# Altium project EduSAT EPSv2.PrjPcb (part 1 of 2)
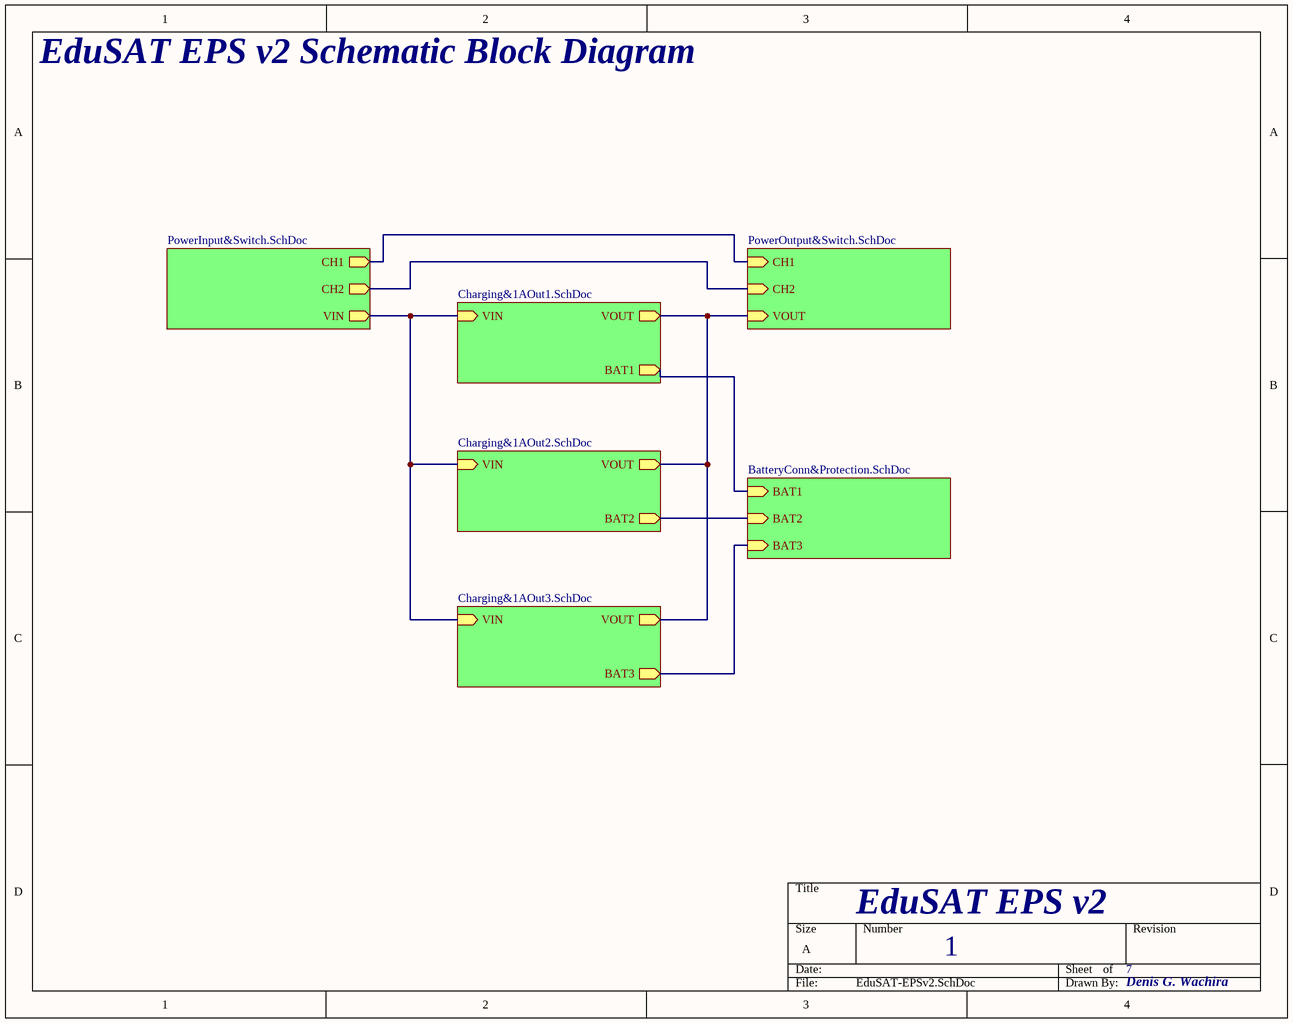
[diagram p0: EduSAT-EPSv2.SchDoc]
7 sheets, 128 parts. Net scope: hierarchical (ports join the sheet entries above them; power ports are global).
Board file: EduSAT-EPSv2.PcbDoc
Sheets:
  EduSAT-EPSv2.SchDoc
    U_BatteryConn&Protection = BatteryConn&Protection.SchDoc
    U_Charging&1AOut1 = Charging&1AOut1.SchDoc
    U_PowerInput&Switch = PowerInput&Switch.SchDoc
    U_Charging&1AOut2 = Charging&1AOut2.SchDoc
    U_Charging&1AOut3 = Charging&1AOut3.SchDoc
    U_PowerOutput&Switch = PowerOutput&Switch.SchDoc

## Sheet EduSAT-EPSv2.SchDoc
size A; DocumentNumber: 1; SheetNumber: 1; SheetTotal: 7

### Sub-sheets
U_BatteryConn&Protection = BatteryConn&Protection.SchDoc: BAT1 (in), BAT2 (in), BAT3 (in)
U_Charging&1AOut1 = Charging&1AOut1.SchDoc: VOUT (out), VIN (in), BAT1 (out)
U_Charging&1AOut2 = Charging&1AOut2.SchDoc: VOUT (out), VIN (in), BAT2 (out)
U_Charging&1AOut3 = Charging&1AOut3.SchDoc: VOUT (out), VIN (in), BAT3 (out)
U_PowerInput&Switch = PowerInput&Switch.SchDoc: CH1 (out), VIN (out), CH2 (out)
U_PowerOutput&Switch = PowerOutput&Switch.SchDoc: VOUT (in), CH1 (in), CH2 (in)

### Nets
BAT1: sheet U_BatteryConn&Protection/BAT1, sheet U_Charging&1AOut1/BAT1
BAT2: sheet U_BatteryConn&Protection/BAT2, sheet U_Charging&1AOut2/BAT2
BAT3: sheet U_BatteryConn&Protection/BAT3, sheet U_Charging&1AOut3/BAT3
SolVOUT: sheet U_PowerInput&Switch/CH2, sheet U_PowerOutput&Switch/CH2
U1VIOUT: sheet U_PowerInput&Switch/CH1, sheet U_PowerOutput&Switch/CH1
VIN: sheet U_Charging&1AOut1/VIN, sheet U_PowerInput&Switch/VIN, sheet U_Charging&1AOut2/VIN, sheet U_Charging&1AOut3/VIN
VOUT: sheet U_Charging&1AOut1/VOUT, sheet U_Charging&1AOut2/VOUT, sheet U_Charging&1AOut3/VOUT, sheet U_PowerOutput&Switch/VOUT

### Notes on the sheet
- EduSAT EPS v2 Schematic Block Diagram
- EduSAT EPS v2
- Denis G. Wachira

## Sheet BatteryConn&Protection.SchDoc
size A; DocumentNumber: 3; SheetNumber: 3; SheetTotal: 7
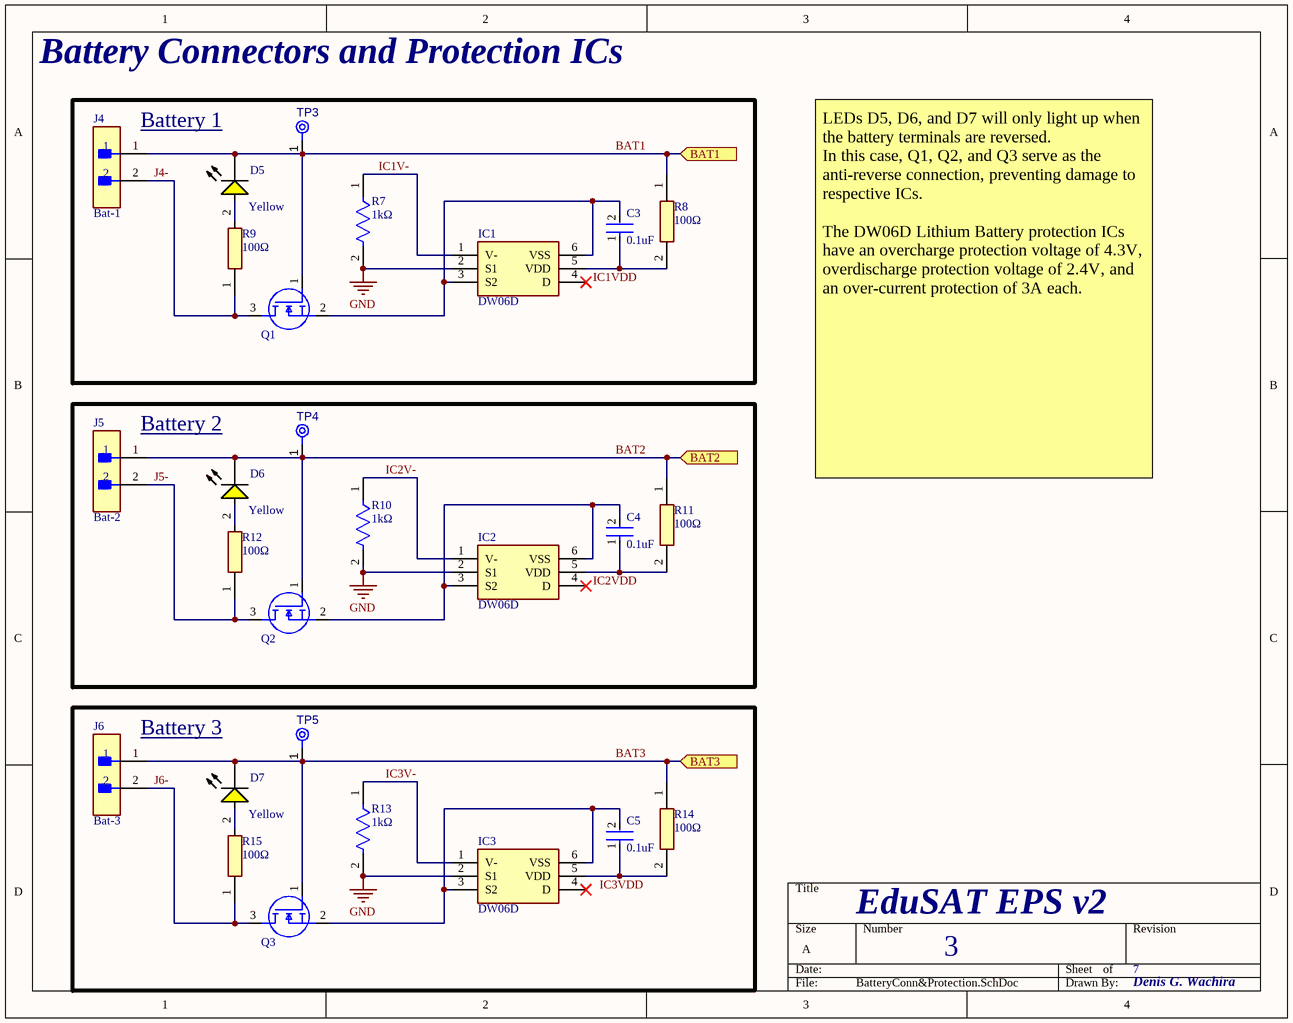
[diagram p1: BatteryConn&Protection.SchDoc]

### Parts
C3  0.1uF  [FP-CL21-IPC_A]
C4  0.1uF  [FP-CL21-IPC_A]
C5  0.1uF  [FP-CL21-IPC_A]
D5  Yellow  [LTST-C170KSKT_V]
D6  Yellow  [LTST-C170KSKT_V]
D7  Yellow  [LTST-C170KSKT_V]
IC1  DW06D  [SOT95P280X135-6N]
IC2  DW06D  [SOT95P280X135-6N]
IC3  DW06D  [SOT95P280X135-6N]
J4  Bat-1  [FP-S2B-XH-A-1_LF_SN-MFG]
J5  Bat-2  [FP-S2B-XH-A-1_LF_SN-MFG]
J6  Bat-3  [FP-S2B-XH-A-1_LF_SN-MFG]
Q1  (no value)  [SOT95P237X112-3N]
Q2  (no value)  [SOT95P237X112-3N]
Q3  (no value)  [SOT95P237X112-3N]
R7  1kΩ  [FP-MCR10-IPC_A]
R8  100Ω  [RESC2012X65N]
R9  100Ω  [RESC2012X65N]
R10  1kΩ  [FP-MCR10-IPC_A]
R11  100Ω  [RESC2012X65N]
R12  100Ω  [RESC2012X65N]
R13  1kΩ  [FP-MCR10-IPC_A]
R14  100Ω  [RESC2012X65N]
R15  100Ω  [RESC2012X65N]
TP3  TPAD6R  [TP06R]  (value not drawn)  (no BOM)
TP4  TPAD6R  [TP06R]  (value not drawn)  (no BOM)
TP5  TPAD6R  [TP06R]  (value not drawn)  (no BOM)

### Blocks framed on the sheet
Battery 1: C3 D5 IC1 J4 Q1 R7-R9 TP3
Battery 2: C4 D6 IC2 J5 Q2 R10-R12 TP4
Battery 3: C5 D7 IC3 J6 Q3 R13-R15 TP5

### Ports
BAT1 (in, see EduSAT-EPSv2[3B], Charging&1AOut1[4B]), BAT2 (in, see EduSAT-EPSv2[3C], Charging&1AOut2[4B]), BAT3 (in, see EduSAT-EPSv2[3C], Charging&1AOut3[4B])

### Nets
GND: IC1.2(S1) IC2.2(S1) IC3.2(S1) R7.2 R10.2 R13.2
BAT1: D5.2(K) J4.1 Q1.1(G) R8.1 TP3.1(TP) ; port BAT1
BAT2: D6.2(K) J5.1 Q2.1(G) R11.1 TP4.1(TP) ; port BAT2
BAT3: D7.2(K) J6.1 Q3.1(G) R14.1 TP5.1(TP) ; port BAT3
IC1V-: IC1.1(V-) R7.1
IC1VDD: C3.1 IC1.5(VDD) R8.2
IC2V-: IC2.1(V-) R10.1
IC2VDD: C4.1 IC2.5(VDD) R11.2
IC3V-: IC3.1(V-) R13.1
IC3VDD: C5.1 IC3.5(VDD) R14.2
J4-: J4.2 Q1.3(D) R9.1
J5-: J5.2 Q2.3(D) R12.1
J6-: J6.2 Q3.3(D) R15.1
NetC3_2: C3.2 IC1.3(S2) IC1.6(VSS) Q1.2(S)
NetC4_2: C4.2 IC2.3(S2) IC2.6(VSS) Q2.2(S)
NetC5_2: C5.2 IC3.3(S2) IC3.6(VSS) Q3.2(S)
NetD5_1: D5.1(A) R9.2
NetD6_1: D6.1(A) R12.2
NetD7_1: D7.1(A) R15.2

Not connected (* = marked no-connect by the designer): IC1 4(D)*; IC2 4(D)*; IC3 4(D)*

### Notes on the sheet
- Battery Connectors and Protection ICs
- LEDs D5, D6, and D7 will only light up when the battery terminals are reversed.
  In this case, Q1, Q2, and Q3 serve as the anti-reverse connection, preventing damage to respective ICs.
  The DW06D Lithium Battery protection ICs have an overcharge protection voltage of 4.3V, overdischarge protection voltage of 2.4V, and an over-current protection of 3A each.
- EduSAT EPS v2
- Denis G. Wachira

### Library data of the parts
C3-C5 = CMP-13271-002975-1: 50V 0.1uF X7R ±10% 0805 Multilayer Ceramic Capacitors MLCC - SMD/SMT ROHS TCC0805X7R104K500DT; Case Code (Imperial): 0805; Length: 2mm; Case/Package: 0805; Packaging: Tape and Reel; Width: 0.049inch; Tolerance: 10%; Mount: Surface Mount; Min Operating Temperature: -55°C; Thickness: 0.057inch; Height: 1.25mm; Dielectric: X7R; Package Quantity: 1; Depth: 1.25mm; Capacitance: 0.1uF; Voltage Rating: 50V; Case Code (Metric): 2012; Max Operating Temperature: 85°C; Radiation Hardening: No
D5-D7 = CMP-2000-06621-1: LED Yellow, 75 mW, 80 mA, -55 to 85 degC, 2-Pin SMD, RoHS, Tape and Reel KT-0805Y; Manufacturer: Lite-On; Main Category: ChipLED; Product Depth (mm): 1.25mm; Dominant Wave Length: 587nm; Viewing Angle: 130deg; Luminous Intensity: 112mcd; Test Current (It): 20mA; Emitting Color: Amber; Chip Material: AlGaInP; Product Height (mm): 1.1mm; Forward Voltage: 2.4V; High Brightness: Yes; Forward Current: 30mA; Number of  Elements: 1; Power Dissipation: 75W; Type: Uni-Color; Shape Type: Rectangular; Peak Wavelength: 588nm; Reverse Voltage: 5V; Rad Hardened: No; Product Length (mm): 2mm; DELETED: Compliant; Package Description: 2-Pin Surface Mount Device, Body 2 x 1.25 mm; Mounting: SurfaceMount; Lum Intensity: 112mcd; Pin Count: 2; Mounting Technology: SurfaceMount; Package Reference: C170KSKT; Datasheet Version: Rev. H, 04/2014; Package Type: ChipLed; Packaging: TapeandReel; Manufacturer URL: http://www.us.liteon.com/; Datasheet URL: http://optoelectronics.liteon.com/upload/download/DS-22-99-0188/S_110_LTST-C170KSKT.pdf; Operating Temp Range: -55Cto85C; Lens Dimensions: 1.4x1.25x0.6mm; Operating Temperature Classification: Industrial
IC1-IC3 = DW06D: Integrated Circuit; Manufacturer_Name: SHEN ZHEN FINE MAD ELECTRONICS GROUP; Datasheet Link: https://datasheet.lcsc.com/szlcsc/Shenzhen-Fuman-Elec-DW06D_C82123.pdf; Height: 1.35mm; Manufacturer_Part_Number: DW06D
J4-J6 = CMP-17439-000260-1: CONN HEADER R/A 2POS 2.5MM HCZZ0139-2; Voltage Rating: 250V; Number of Positions: 2; Contact Material: Brass; Series: XH; Contact Finish - Mating: TIN; Max Operating Temperature: 85°C; Number of Rows: 1; Packaging: Bulk; Insulation Color: Natural; Lead Free: Lead Free; Fastening Type: Detent; Termination: Press-Fit; Connector Type: Header; Insulation Material: Nylon; Contact Shape: Square; Contact Type: Male Pin; Mount: Through Hole; Min Operating Temperature: -25°C; Flammability Rating: UL94 V-0
Q1-Q3 = IRLML6344TRPBF: MOSFET (N-Channel)IRLML6344TRPBF; Manufacturer_Name: Infineon; Datasheet Link: https://www.infineon.com/dgdl/irlml6344pbf.pdf?fileId=5546d462533600a4015356689c44262c; Height: 1.12mm; Manufacturer_Part_Number: IRLML6344TRPBF; Mouser Part Number: 942-IRLML6344TRPBF; Mouser Price/Stock: https://www.mouser.co.uk/ProductDetail/Infineon-Technologies/IRLML6344TRPBF?qs=9%252BKlkBgLFf2w4qS48UOXVw%3D%3D; Arrow Part Number: IRLML6344TRPBF; Arrow Price/Stock: https://www.arrow.com/en/products/irlml6344trpbf/infineon-technologies-ag?region=europe
R7 R10 R13 = CMP-08839-023103-1: Thick Film Chip Resistor, 0805, 1kΩ, 1%, 100ppm/°C, 0.125W, 150V 0805W8F1001T5E; Power Rating: 125mW; Resistance: 1kR; Max Operating Temperature: 155°C; Length: 0.079inch; Case/Package: 0805; Tolerance: 1%; Mount: Surface Mount; Packaging: Tape and Reel; Number of Terminations: 2; Voltage Rating (DC): 150V; RoHS Compliant: Yes; Case Code (Metric): 2012; Lead Free: Lead Free; Max Power Dissipation: 125mW; Height: 0.024inch; Temperature Coefficient: 100ppm/°C; Resistor Type: Thick Film; Case Code (Imperial): 0805; Package Quantity: 5000; Contact Plating: Tin; Width: 0.049inch; Min Operating Temperature: -55°C
R8 R9 = AECR0805F27R0K9: 125mW Thick Film Resistors 150V ±100ppm/℃ ±1% 100Ω 0805 Chip Resistor - Surface Mount ROHS AECR0805F100RK9; Manufacturer_Name: ResistorToday; Datasheet Link: https://datasheet.lcsc.com/lcsc/2304140030_RESI-AECR0805F27R0K9_C352233.pdf; Height: 0.65mm; Manufacturer_Part_Number: AECR0805F27R0K9
R11 R12 R14 R15 = AECR0805F27R0K9: 125mW Thick Film Resistors 150V ±100ppm/℃ ±1% 100Ω 0805 Chip Resistor - Surface Mount ROHSAECR0805F100RK9; Manufacturer_Name: ResistorToday; Datasheet Link: https://datasheet.lcsc.com/lcsc/2304140030_RESI-AECR0805F27R0K9_C352233.pdf; Height: 0.65mm; Manufacturer_Part_Number: AECR0805F27R0K9
TP3-TP5 = CMP-00028-00002-2: 0.6mm round; Pins: 1

## Sheet Charging&1AOut1.SchDoc
size A; DocumentNumber: 4; SheetNumber: 4; SheetTotal: 7
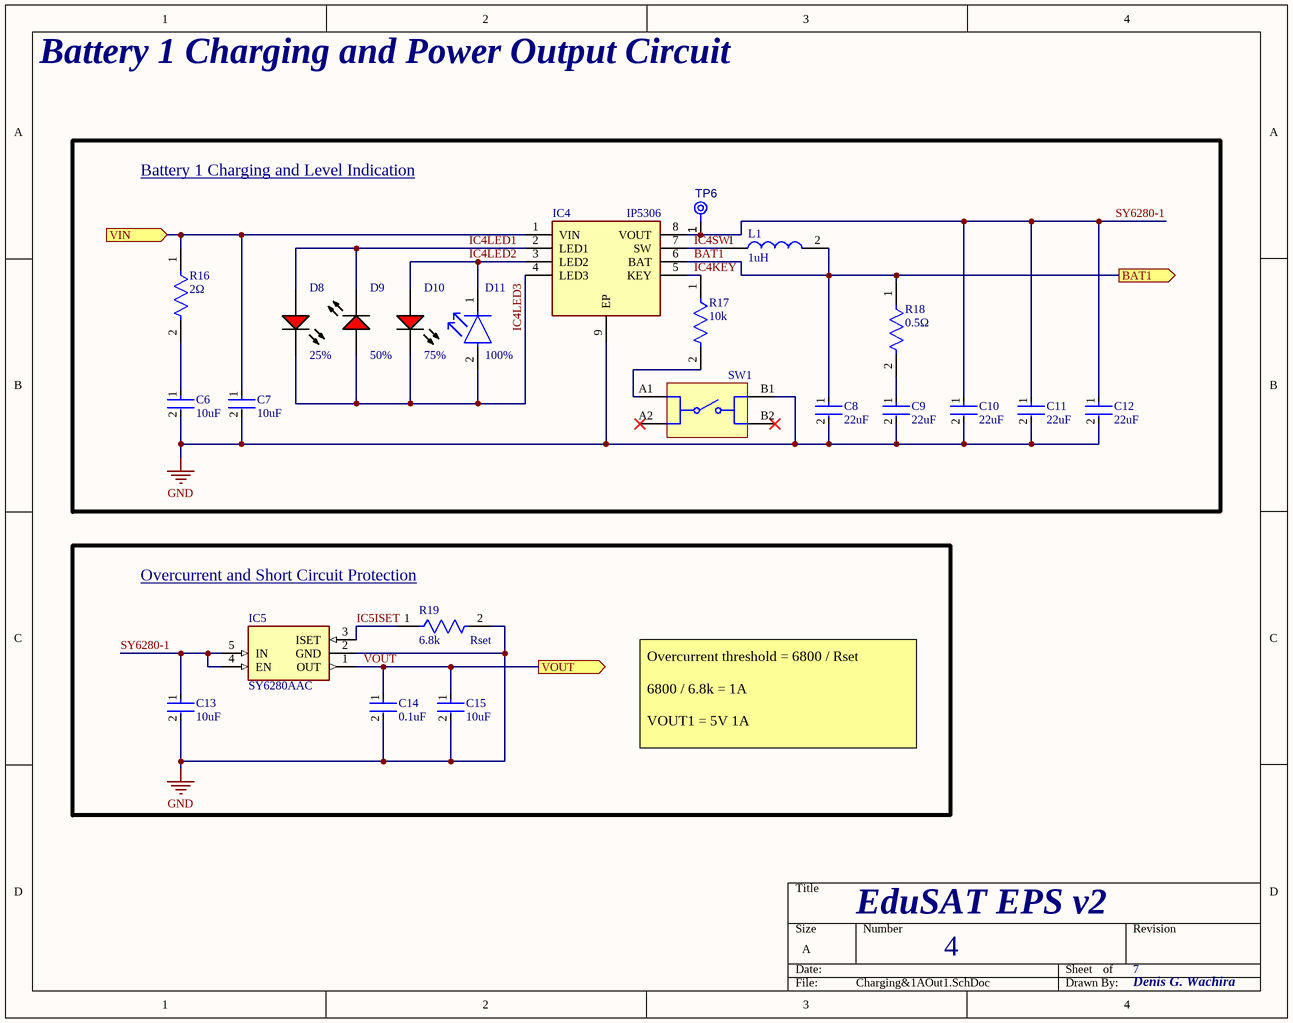
[diagram p2: Charging&1AOut1.SchDoc]

### Parts
C6  10uF  [FP-CL21-IPC_A]
C7  10uF  [FP-CL21-IPC_A]
C8  22uF  [FP-CL21-IPC_C]
C9  22uF  [FP-CL21-IPC_C]
C10  22uF  [FP-CL21-IPC_C]
C11  22uF  [FP-CL21-IPC_C]
C12  22uF  [FP-CL21-IPC_C]
C13  10uF  [FP-CL21-IPC_A]
C14  0.1uF  [FP-CL21-IPC_A]
C15  10uF  [FP-CL21-IPC_A]
D8  25%  [LTST-C170KRKT_V]
D9  50%  [LTST-C170KRKT_V]
D10  75%  [LTST-C170KRKT_V]
D11  100%  [FP-LTST-C170GKT-MFG]
IC4  IP5306  [SOIC127P600X165-9N]
IC5  SY6280AAC  [SOT95P285X140-5N]
L1  1uH  [INDPM7366X300N]
R16  2Ω  [FP-CR0805-IPC_B]
R17  10k  [FP-MCR10-IPC_C]
R18  0.5Ω  [FP-MCR10-IPC_C]
R19  6.8k          Rset  [FP-MCR10-IPC_C]
SW1  430181038816  [WS-TASV_L4.5W4.5H3.8_430181038816]  (value not drawn)
TP6  TPAD6R  [TP06R]  (value not drawn)  (no BOM)

### Blocks framed on the sheet
Battery 1 Charging and Level Indication: C6-C12 D8-D11 IC4 L1 R16-R18 SW1 TP6
Overcurrent and Short Circuit Protection: C13-C15 IC5 R19

### Ports
BAT1 (out, see EduSAT-EPSv2[3B], BatteryConn&Protection[3A]), VIN (in, see EduSAT-EPSv2[2B], Charging&1AOut2[1A], Charging&1AOut3[1A], PowerInput&Switch[4C]), VOUT (out, see EduSAT-EPSv2[3B], Charging&1AOut2[2C], Charging&1AOut3[2C], PowerOutput&Switch[1A])

### Nets
GND: C6.2 C7.2 C8.2 C9.2 C10.2 C11.2 C12.2 C13.2 C14.2 C15.2 IC4.9(EP) IC5.2(GND) R19.2 SW1.B1
BAT1: C8.1 IC4.6(BAT) L1.2 R18.1 ; port BAT1
IC4KEY: IC4.5(KEY) R17.1
IC4LED1: D8.1(A) D9.2(K) IC4.2(LED1)
IC4LED2: D10.1(A) D11.1(C) IC4.3(LED2)
IC4LED3: D8.2(K) D9.1(A) D10.2(K) D11.2(A) IC4.4(LED3)
IC4SW: IC4.7(SW) L1.1
IC5ISET: IC5.3(ISET) R19.1
SY6280-1: C10.1 C11.1 C12.1 C13.1 IC4.8(VOUT) IC5.4(EN) IC5.5(IN) TP6.1(TP)
VIN: C7.1 IC4.1(VIN) R16.1 ; port VIN
VOUT: C14.1 C15.1 IC5.1(OUT) ; port VOUT
NetC6_1: C6.1 R16.2
NetC9_1: C9.1 R18.2
NetR17_2: R17.2 SW1.A1

Not connected (* = marked no-connect by the designer): SW1 A2* B2*

### Notes on the sheet
- Battery 1 Charging and Power Output Circuit
- Overcurrent threshold = 6800 / Rset
  6800 / 6.8k = 1A
  VOUT1 = 5V 1A
- EduSAT EPS v2
- Denis G. Wachira

### Library data of the parts
C6 C7 C13 C15 = CMP-13271-002975-1: CL21 Series 0805 10uF 25V ±10% Tolerance X5R Multilayer Ceramic Chip Capacitor CL21A106KAYNNNE; Case Code (Imperial): 0805; Length: 2mm; Case/Package: 0805; Packaging: Tape and Reel; Width: 0.049inch; Tolerance: 10%; Mount: Surface Mount; Min Operating Temperature: -55°C; Thickness: 0.057inch; Height: 1.25mm; Dielectric: X5R; Package Quantity: 1; Depth: 1.25mm; Capacitance: 10uF; Voltage Rating: 25V; Case Code (Metric): 2012; Max Operating Temperature: 85°C; Radiation Hardening: No
C8-C12 = CMP-13271-003225-1: CL21 Series 0805 22uF 25V ±20% Tolerance X5R Multilayer Ceramic Chip Capacitor CL21A226MAYNNNE
C14 = CMP-13271-002975-1: as C3 on sheet BatteryConn&Protection; Case Code (Imperial): 0805; Length: 2mm; Case/Package: 0805; Packaging: Tape and Reel; Width: 0.049inch; Tolerance: 10%; Mount: Surface Mount; Min Operating Temperature: -55°C; Thickness: 0.057inch; Height: 1.25mm; Dielectric: X7R; Package Quantity: 1; Depth: 1.25mm; Capacitance: 0.1uF; Voltage Rating: 50V; Case Code (Metric): 2012; Max Operating Temperature: 85°C; Radiation Hardening: No
D8 = CMP-2000-07593-1: LED Red,KT-0805R; Manufacturer: Lite-On; Lens Transparency: Clear; Number of Elements: 1; Power Rating: 75mW; Luminous Intensity: 54mcd; Viewing Angle: 130degrees; Forward Current: 30mA; Wavelength: 639nm; Lens Style: Rectangular; Case\/Package: 0805; Test Current: 20mA; Dominant Wavelength: 631nm; Forward Voltage: 2V; Lens Colour: Colorless; Min Operating Temperature: -55degC; RoHSCompliant: True; Length: 3.2mm; Width: 1.25mm; Mount: SurfaceMount; Packaging: TapeandReel; Number of LEDs: 1; Radiation Hardening: No; Datasheet URL: http://optoelectronics.liteon.com/upload/download/DS-22-99-0150/LTST-C170KRKT.pdf; Datasheet Version: Rev. D, 11/2014; Case Code (Metric): 2012; Height: 1.1mm; Number of Pins: 2; Package Description: 2-Pin Surface Mount Device, Body 2 x 1.25 mm; Manufacturer URL: http://www.us.liteon.com/; Lead Free: LeadFree; Illumination Colour: Red; Colour: Red; Case Code (Imperial): 0805; Max Operating Temperature: 85degC; Power Dissipation: 75mW; Mounting Technology: SurfaceMount; Package Reference: C170KRKT; Package Quantity: 1; Depth: 1.6mm
D9 D10 = CMP-2000-07593-1: LED Red, KT-0805R; Manufacturer: Lite-On; Lens Transparency: Clear; Number of Elements: 1; Power Rating: 75mW; Luminous Intensity: 54mcd; Viewing Angle: 130degrees; Forward Current: 30mA; Wavelength: 639nm; Lens Style: Rectangular; Case\/Package: 0805; Test Current: 20mA; Dominant Wavelength: 631nm; Forward Voltage: 2V; Lens Colour: Colorless; Min Operating Temperature: -55degC; RoHSCompliant: True; Length: 3.2mm; Width: 1.25mm; Mount: SurfaceMount; Packaging: TapeandReel; Number of LEDs: 1; Radiation Hardening: No; Datasheet URL: http://optoelectronics.liteon.com/upload/download/DS-22-99-0150/LTST-C170KRKT.pdf; Datasheet Version: Rev. D, 11/2014; Case Code (Metric): 2012; Height: 1.1mm; Number of Pins: 2; Package Description: 2-Pin Surface Mount Device, Body 2 x 1.25 mm; Manufacturer URL: http://www.us.liteon.com/; Lead Free: LeadFree; Illumination Colour: Red; Colour: Red; Case Code (Imperial): 0805; Max Operating Temperature: 85degC; Power Dissipation: 75mW; Mounting Technology: SurfaceMount; Package Reference: C170KRKT; Package Quantity: 1; Depth: 1.6mm
D11 = CMP-1674-00002-6: LED GREEN CLEAR SMD KT-0805G; Dominant Wavelength: 569nm; Lens Style: Diffused; Forward Voltage: 2.1V; Number of Elements: 1; Wavelength: 565nm; Luminous Intensity: 6mcd; Test Current: 10mA; Power Dissipation: 100mW; Reverse Voltage: 5V; Forward Current: 30mA; Viewing Angle: 130°; Lens Color: Colorless; Min Operating Temperature: -55°C; Number of Pins: 2; Max Operating Temperature: 85°C; Color: Green; Radiation Hardening: No; Illumination Color: Green; Case Code (Metric): 2012; Lens Transparency: Clear; Case/Package: 0805; Width: 1.25mm; Case Code (Imperial): 0805; Package Quantity: 1; Height: 1.1mm; Depth: 1.25mm; Length: 2mm; Power Rating: 100mW; Lead Free: Lead Free; Number of LEDs: 1; Packaging: Tape and Reel; Mount: Surface Mount; Voltage: 5V
IC4 = IP5306: Integrated Circuit; Manufacturer_Name: INJOINIC; Datasheet Link: https://datasheetspdf.com/pdf-file/1139129/Injoinic/IP5306/1; Height: 1.65mm; Manufacturer_Part_Number: IP5306
IC5 = SY6280AAC: Integrated Circuit; Manufacturer_Name: Silergy; Datasheet Link: https://datasheet.lcsc.com/szlcsc/Silergy-Corp-SY6280AAC_C55136.pdf; Height: 1.4mm; Manufacturer_Part_Number: SY6280AAC
L1 = MCS0630-2R2MN2: Inductor MCS0630-1R0MN2; Manufacturer_Name: Prosperity Dielectrics; Height: 3mm; Manufacturer_Part_Number: MCS0630-1R0MN2
R16 = CMP-07231-004400-1: Thick Film Chip Resistors 0805 2Ω 0.125W 1% 250ppm/°C / RS-05L2R00FT; Power Rating: 125mW; Voltage Rating: 150V; Packaging: Tape and Reel; Thickness: 508um; Case Code (Metric): 2012; Military Standard: Not; Height: 0.5mm; Depth: 1.25mm; Weight: 0.000194oz; Length: 2mm; Resistance: 2Ω; Min Operating Temperature: -55°C; Radiation Hardening: No; Case/Package: 0805; Tolerance: 1%; Mount: Surface Mount; Width: 1.25mm; Max Operating Temperature: 155°C; Contact Plating: Tin; Temperature Coefficient: 250ppm/°C; Case Code (Imperial): 0805; Composition: Thick Film; Termination: SMD/SMT
R17 = CMP-08839-012433-1: Thick Film Chip Resistor, 0805, 10kΩ, 1%, 100ppm/°C, 0.125W, 150V / 0805W8F1002T5E; Resistance: 10kR; Power Rating: 125mW; Resistor Type: Thick Film; Contact Plating: Tin; Length: 2mm; Tolerance: 1%; Temperature Coefficient: 100ppm/°C; Max Operating Temperature: 155°C; Min Operating Temperature: -55°C; Height: 550um; Voltage Rating (DC): 150V; Mount: Surface Mount; Case/Package: 0805; Lead Free: Lead Free; Width: 1.25mm; Radiation Hardening: No; Working Voltage: 150V; Number of Terminations: 2
R18 = CMP-08839-012433-1: Thick Film Chip Resistor, 0805, 0.5R, 1%, 100ppm/°C, 0.125W, 150V / 0805W8F500LT5E; Resistance: 10kR; Power Rating: 125mW; Resistor Type: Thick Film; Contact Plating: Tin; Length: 2mm; Tolerance: 1%; Temperature Coefficient: 100ppm/°C; Max Operating Temperature: 155°C; Min Operating Temperature: -55°C; Height: 550um; Voltage Rating (DC): 150V; Mount: Surface Mount; Case/Package: 0805; Lead Free: Lead Free; Width: 1.25mm; Radiation Hardening: No; Working Voltage: 150V; Number of Terminations: 2
R19 = CMP-08839-012433-1: Thick Film Chip Resistor, 0805, 6.8kΩ, 1%, 100ppm/°C, 0.125W, 150V / 0805W8F6801T5E; Resistance: 10kR; Power Rating: 125mW; Resistor Type: Thick Film; Contact Plating: Tin; Length: 2mm; Tolerance: 1%; Temperature Coefficient: 100ppm/°C; Max Operating Temperature: 155°C; Min Operating Temperature: -55°C; Height: 550um; Voltage Rating (DC): 150V; Mount: Surface Mount; Case/Package: 0805; Lead Free: Lead Free; Width: 1.25mm; Radiation Hardening: No; Working Voltage: 150V; Number of Terminations: 2
SW1 = CMP-1454-00001-2: 4.5mm 3.5mm 50mA Round Button Brick nogging 4.5mm 260gf 12V SMD Tactile Switches ROHS / TSC015A03526A; NexarPartId: 57114477; Switch Function: Off-Mom; Actuator Material: Liquid Crystal Polymer, Polymer; Insulation Resistance: 100MΩ; Throw Configuration: SPST; Switch Travel: 200µm; Illumination Type: Non-Illuminated; Mechanical Life: 1Mcycles; Current Rating: 50mA; RoHS: Compliant; Termination: SMD/SMT; Packaging: Tape and Reel; Height: 3.8mm; Mount: Surface Mount; Max Operating Temperature: 85°C; Voltage Rating: 12V; Contact Plating: Silver; Min Operating Temperature: -40°C
TP6 = CMP-00028-00002-2: 0.6mm round; Pins: 1

## Sheet PowerInput&Switch.SchDoc
size A; DocumentNumber: 2; SheetNumber: 2; SheetTotal: 7
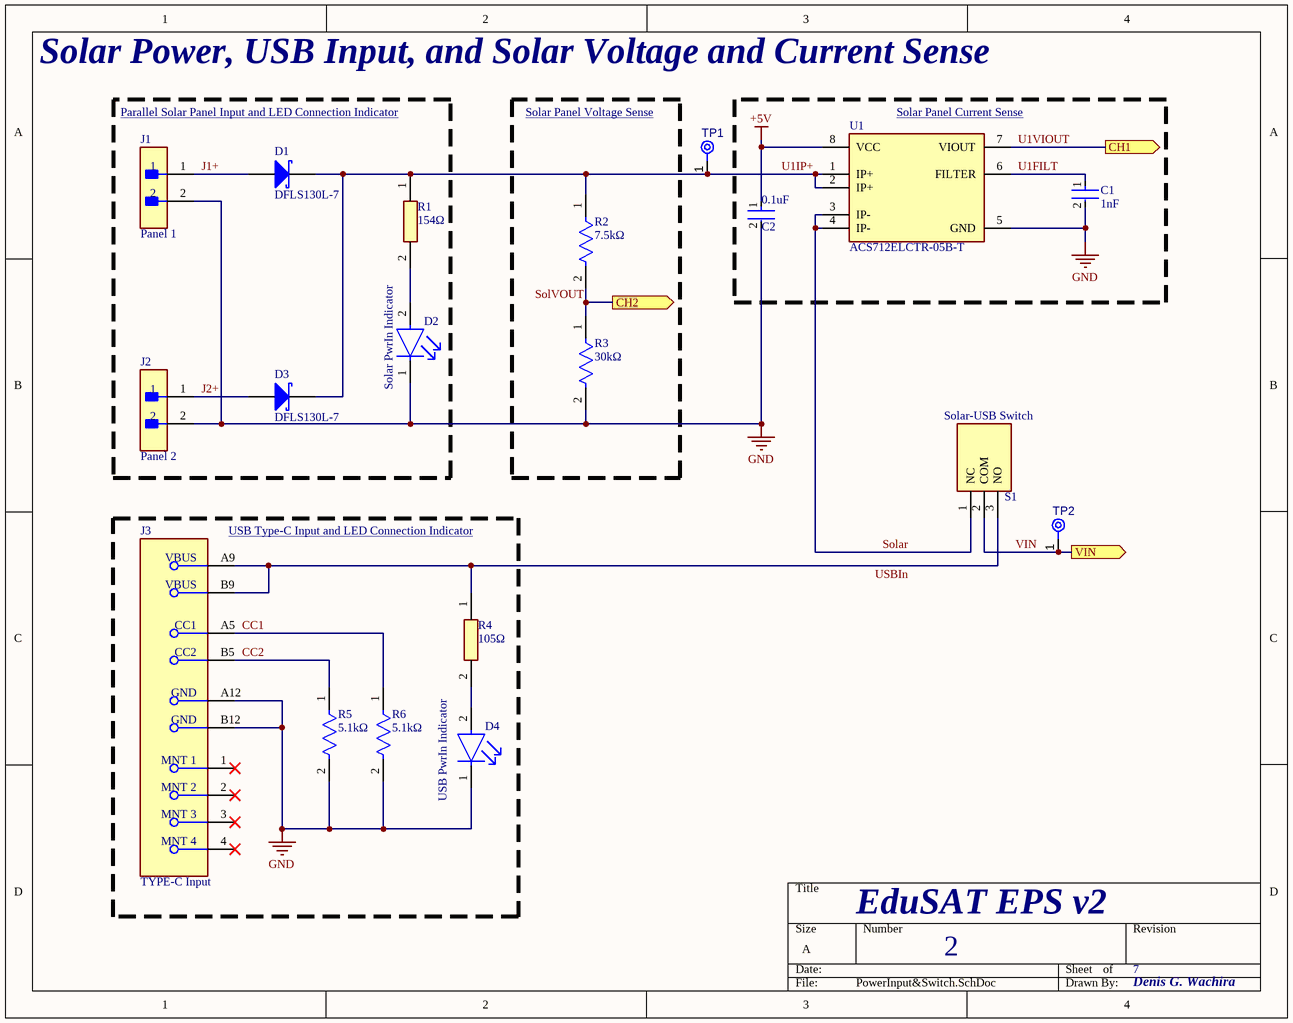
[diagram p3: PowerInput&Switch.SchDoc]

### Parts
C1  1nF  [FP-CL21-IPC_B]
C2  0.1uF  [FP-CL21-IPC_A]
D1  DFLS130L-7  [DIOD-POWERDI123-2_A_V]
D2  Solar PwrIn Indicator  [FP-LTST-C170GKT-MFG]
D3  DFLS130L-7  [DIOD-POWERDI123-2_A_V]
D4  USB PwrIn Indicator  [FP-LTST-C170GKT-MFG]
J1  Panel 1  [FP-S2B-XH-A-1_LF_SN-MFG]
J2  Panel 2  [FP-S2B-XH-A-1_LF_SN-MFG]
J3  TYPE-C Input  [FP-USB4125-GF-A-0190-MFG]
R1  154Ω  [RESC2012X65N]
R2  7.5kΩ  [FP-MCR10-IPC_A]
R3  30kΩ  [FP-MCR10-IPC_A]
R4  105Ω  [RESC2012X65N]
R5  5.1kΩ  [FP-MCR10-IPC_A]
R6  5.1kΩ  [FP-MCR10-IPC_A]
S1  Solar-USB Switch  [SS12D10L3]
TP1  TPAD6R  [TP06R]  (value not drawn)  (no BOM)
TP2  TPAD6R  [TP06R]  (value not drawn)  (no BOM)
U1  ACS712ELCTR-05B-T  [FP-LC-8-IPC_A]

### Blocks framed on the sheet
Parallel Solar Panel Input and LED Connection Indicator: D1-D3 J1 J2 R1
Solar Panel Voltage Sense: R2 R3
Solar Panel Current Sense: C1 C2 U1
USB Type-C Input and LED Connection Indicator: D4 J3 R4-R6

### Ports
CH1 (out, see EduSAT-EPSv2[2B], PowerOutput&Switch[3B]), CH2 (out, see EduSAT-EPSv2[2B], PowerOutput&Switch[3A]), VIN (out, see EduSAT-EPSv2[2B], Charging&1AOut1[1A], Charging&1AOut2[1A], Charging&1AOut3[1A])

### Nets
+5V: C2.1 U1.8(VCC)
GND: C1.2 C2.2 D2.1(C) D4.1(C) J1.2 J2.2 J3.A12(GND) J3.B12(GND) R3.2 R5.2 R6.2 U1.5(GND)
CC1: J3.A5(CC1) R6.1
CC2: J3.B5(CC2) R5.1
J1+: D1.1(A) J1.1
J2+: D3.1(A) J2.1
Solar: S1.1(NC) U1.3(IP-) U1.4(IP-)
SolVOUT: R2.2 R3.1 ; port CH2
U1FILT: C1.1 U1.6(FILTER)
U1IP+: D1.2(K) D3.2(K) R1.1 R2.1 TP1.1(TP) U1.1(IP+) U1.2(IP+)
U1VIOUT: U1.7(VIOUT) ; port CH1
USBIn: J3.A9(VBUS) J3.B9(VBUS) R4.1 S1.3(NO)
VIN: S1.2(COM) TP2.1(TP) ; port VIN
NetD2_2: D2.2(A) R1.2
NetD4_2: D4.2(A) R4.2

Not connected (* = marked no-connect by the designer): J3 1(MNT_1)* 2(MNT_2)* 3(MNT_3)* 4(MNT_4)*

### Notes on the sheet
- Solar Power, USB Input, and Solar Voltage and Current Sense
- EduSAT EPS v2
- Denis G. Wachira

### Library data of the parts
C1 = CMP-13271-001800-1: CL21 Series 0805 1nF 50V ±10% Tolerance X7R Multilayer Ceramic Chip Capacitor / CGA0805X7R102K500KT; Contact Plating: Tin; Tolerance: 10%; Package Quantity: 4000; Voltage: 50V; Mount: Surface Mount; Material: Ceramic; Width: 0.049inch; Capacitance: 1nF; Case Code (Metric): 2012; Case Code (Imperial): 0805; Height: 0.65mm; Max Operating Temperature: 125°C; Thickness: 0.03inch; Length: 2mm; Radiation Hardening: No; Depth: 1.25mm; Packaging: Tape and Reel; Voltage Rating: 50V; Dielectric: X7R; Min Operating Temperature: -55°C; Case/Package: 0805
C2 = CMP-13271-002975-1: as C3 on sheet BatteryConn&Protection; Case Code (Imperial): 0805; Length: 2mm; Case/Package: 0805; Packaging: Tape and Reel; Width: 0.049inch; Tolerance: 10%; Mount: Surface Mount; Min Operating Temperature: -55°C; Thickness: 0.057inch; Height: 1.25mm; Dielectric: X7R; Package Quantity: 1; Depth: 1.25mm; Capacitance: 0.1uF; Voltage Rating: 50V; Case Code (Metric): 2012; Max Operating Temperature: 85°C; Radiation Hardening: No
D1 D3 = CMP-2000-07448-1: Schottky Barrier Rectifier, 30 V, 1 A, -40 to 125 degC, 2-Pin SMD, RoHS, Tape and Reel; Manufacturer: Diodes Inc; Max Repetitive Reverse Voltage (Vrrm): 30V; Polarity: Standard; Average Rectified Current: 1A; Element Configuration: Single; Forward Voltage: 360mV; Peak Non-Repetitive Surge Current: 50A; Max Power Dissipation: 1.67W; Case\/Package: SMD/SMT; Capacitance: 76pF; Peak Reverse Current: 1mA; Datasheet URL: https://www.diodes.com/assets/Datasheets/ds30492.pdf; Package Quantity: 3000; Reverse Voltage (DC): 30V; Package Reference: POWERDI123-2_A; Lead Free: LeadFree; Mounting Technology: SurfaceMount; Max Operating Temperature: 125degC; Current Rating: 1A; Radiation Hardening: No; Width: 1.78mm; Height: 0.98mm; Output Current: 1A; Contact Plating: Matte; Length: 2.8mm; Number of Pins: 2; Voltage Rating (DC): 30V; RoHSCompliant: true; Termination: SMD/SMT; Forward Current: 1A; Min Operating Temperature: -40degC; Datasheet Version: Rev. 4-2, 06/2009; Packaging: TapeandReel; REACH SVHC: NoSVHC; Max Forward Surge Current (Ifsm): 50A; Manufacturer URL: http://www.diodes.com/; Mount: SurfaceMount; Package Description: 2-Pin Small Outline Diode, Body 2.8 x 1.78 mm
D2 D4 = CMP-1674-00002-6: as D11 on sheet Charging&1AOut1; Min Operating Temperature: -55°C; Number of Pins: 2; Max Operating Temperature: 85°C; Color: Green; Radiation Hardening: No; Illumination Color: Green; Case Code (Metric): 2012; Lens Transparency: Clear; Case/Package: 0805; Width: 1.25mm; Case Code (Imperial): 0805; Package Quantity: 1; Height: 1.1mm; Depth: 1.25mm; Length: 2mm; Power Rating: 100mW; Lead Free: Lead Free; Number of LEDs: 1; Packaging: Tape and Reel; Mount: Surface Mount; Voltage: 5V
J1 J2 = CMP-17439-000260-1: as J4 on sheet BatteryConn&Protection; Contact Material: Brass; Series: XH; Contact Finish - Mating: TIN; Max Operating Temperature: 85°C; Number of Rows: 1; Packaging: Bulk; Insulation Color: Natural; Lead Free: Lead Free; Fastening Type: Detent; Termination: Press-Fit; Connector Type: Header; Insulation Material: Nylon; Contact Shape: Square; Contact Type: Male Pin; Mount: Through Hole; Min Operating Temperature: -25°C; Flammability Rating: UL94 V-0
J3 = CMP-002-00079-1: 3A 1 Surface Mount，Right Angle 6P Female -40℃~+85℃ Type-C SMD USB Connectors ROHS; Voltage Rating: 20V; RoHS Compliant: Yes; Pins: 6P; Mounting Technology: Surface Mount, Right Angle; Connector Type: Type-C; Gender: Female; Min Operating Temperature: -40°C; Max Operating Temperature: 85°C; Max Current Rating: 3A
R1 = AECR0805F27R0K9: 125mW Thick Film Resistors 150V ±100ppm/℃ ±1% 154Ω 0805 Chip Resistor - Surface Mount ROHS CR0805F81540G; Manufacturer_Name: ResistorToday; Datasheet Link: https://datasheet.lcsc.com/lcsc/2304140030_RESI-AECR0805F27R0K9_C352233.pdf; Height: 0.65mm; Manufacturer_Part_Number: AECR0805F27R0K9
R2 = CMP-08839-023103-1: Thick Film Chip Resistor, 0805, 7.5kΩ, 1%, 100ppm/°C, 0.125W, 150V 0805W8F7501T5E; Power Rating: 125mW; Resistance: 1kR; Max Operating Temperature: 155°C; Length: 0.079inch; Case/Package: 0805; Tolerance: 1%; Mount: Surface Mount; Packaging: Tape and Reel; Number of Terminations: 2; Voltage Rating (DC): 150V; RoHS Compliant: Yes; Case Code (Metric): 2012; Lead Free: Lead Free; Max Power Dissipation: 125mW; Height: 0.024inch; Temperature Coefficient: 100ppm/°C; Resistor Type: Thick Film; Case Code (Imperial): 0805; Package Quantity: 5000; Contact Plating: Tin; Width: 0.049inch; Min Operating Temperature: -55°C
R3 = CMP-08839-023103-1: Thick Film Chip Resistor, 0805, 30kΩ, 1%, 100ppm/°C, 0.125W, 150V 0805W8F7501T5E; Power Rating: 125mW; Resistance: 1kR; Max Operating Temperature: 155°C; Length: 0.079inch; Case/Package: 0805; Tolerance: 1%; Mount: Surface Mount; Packaging: Tape and Reel; Number of Terminations: 2; Voltage Rating (DC): 150V; RoHS Compliant: Yes; Case Code (Metric): 2012; Lead Free: Lead Free; Max Power Dissipation: 125mW; Height: 0.024inch; Temperature Coefficient: 100ppm/°C; Resistor Type: Thick Film; Case Code (Imperial): 0805; Package Quantity: 5000; Contact Plating: Tin; Width: 0.049inch; Min Operating Temperature: -55°C
R4 = AECR0805F27R0K9: 125mW Thick Film Resistors 150V ±100ppm/℃ ±1% 105Ω 0805 Chip Resistor - Surface Mount ROHS CR0805F105RP05Z; Manufacturer_Name: ResistorToday; Datasheet Link: https://datasheet.lcsc.com/lcsc/2304140030_RESI-AECR0805F27R0K9_C352233.pdf; Height: 0.65mm; Manufacturer_Part_Number: AECR0805F27R0K9
R5 R6 = CMP-08839-023103-1: Thick Film Chip Resistor, 0805, 5.1kΩ, 1%, 100ppm/°C, 0.125W, 150V 0805W8F5101T5E; Power Rating: 125mW; Resistance: 1kR; Max Operating Temperature: 155°C; Length: 0.079inch; Case/Package: 0805; Tolerance: 1%; Mount: Surface Mount; Packaging: Tape and Reel; Number of Terminations: 2; Voltage Rating (DC): 150V; RoHS Compliant: Yes; Case Code (Metric): 2012; Lead Free: Lead Free; Max Power Dissipation: 125mW; Height: 0.024inch; Temperature Coefficient: 100ppm/°C; Resistor Type: Thick Film; Case Code (Imperial): 0805; Package Quantity: 5000; Contact Plating: Tin; Width: 0.049inch; Min Operating Temperature: -55°C
S1 = SS-12D10L3: Switch; Manufacturer_Name: XKB Connectivity; Datasheet Link: http://www.helloxkb.com/public/images/pdf/SS-12D10XXX.pdf; Height: 9.6mm; Manufacturer_Part_Number: SS-12D10L3
TP1 TP2 = CMP-00028-00002-2: 0.6mm round; Pins: 1
U1 = CMP-2000-04989-2: SENSOR CURRENT HALL 5A AC/DC; Output Current: 10mA; Response Time: 5us; Number of Channels: 1; Sensitivity: 185mV/A; Polarity: Bidirectional; Linearity: 1.5%; Max Supply Current: 13mA; Frequency: 80kHz; Max Supply Voltage: 5.5V; Min Supply Voltage: 4.5V; Voltage: 5V; Mount: Surface Mount; Max Operating Temperature: 85°C; Min Operating Temperature: -40°C; Termination: SMD/SMT; Number of Pins: 8; Accuracy: 1.5%; Current Sensing: 5A; Length: 4.9mm; Package Quantity: 1; REACH SVHC: No SVHC; Packaging: Cut Tape; Series: -; Height: 1.5mm; Width: 3.9mm; Operating Supply Voltage: 5V; Bandwidth: 80kHz; Case/Package: SOIC; Lead Free: Lead Free; Quiescent Current: 10mA; RoHS Compliant: Yes

## Sheet Charging&1AOut2.SchDoc
size A; DocumentNumber: 5; SheetNumber: 5; SheetTotal: 7
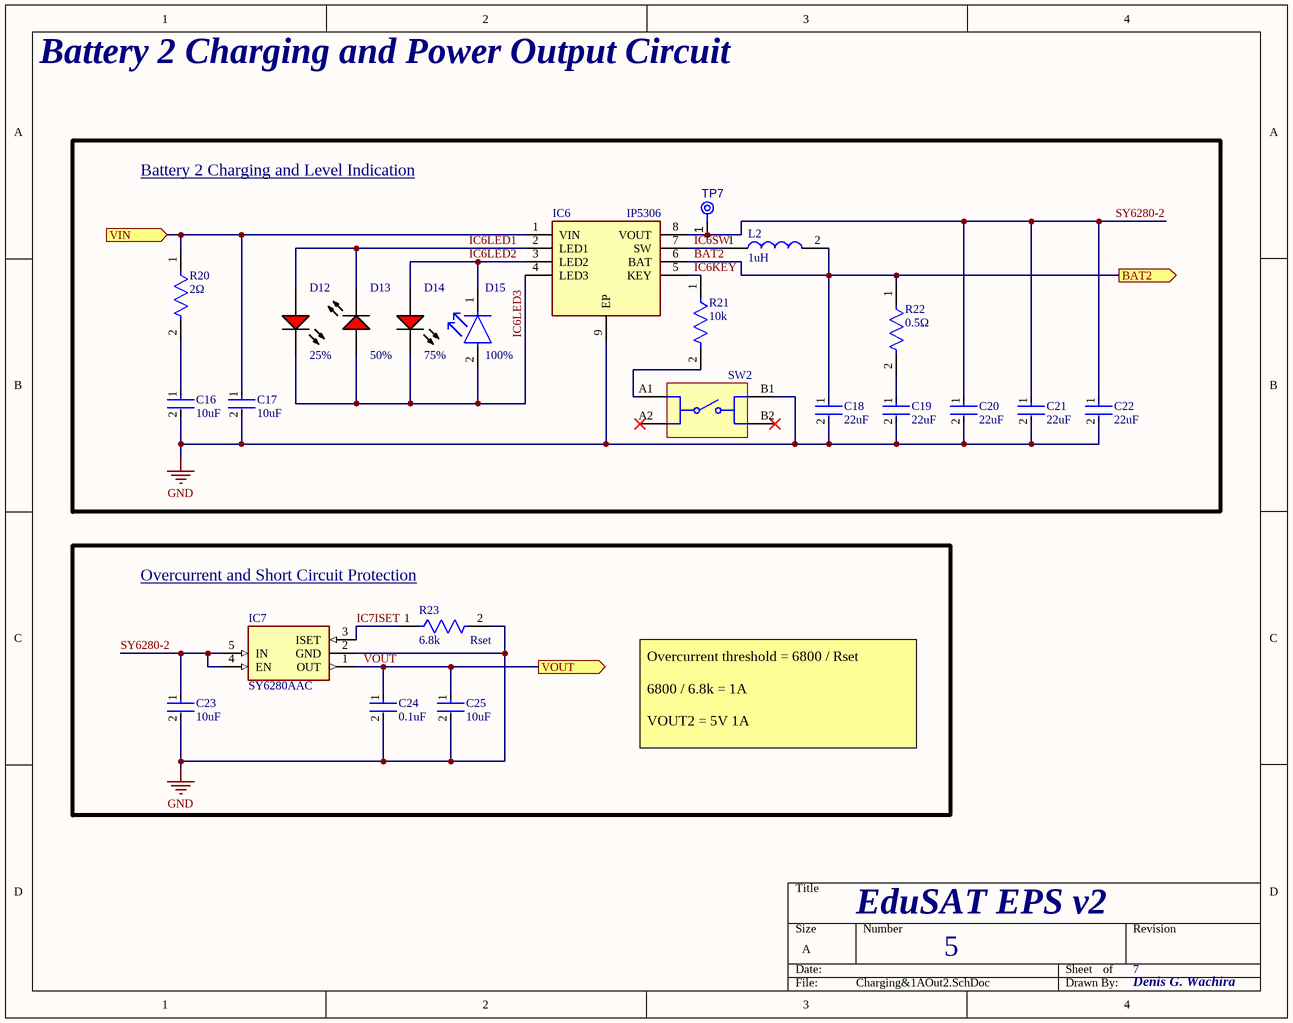
[diagram p4: Charging&1AOut2.SchDoc]

### Parts
C16  10uF  [FP-CL21-IPC_A]
C17  10uF  [FP-CL21-IPC_A]
C18  22uF  [FP-CL21-IPC_C]
C19  22uF  [FP-CL21-IPC_C]
C20  22uF  [FP-CL21-IPC_C]
C21  22uF  [FP-CL21-IPC_C]
C22  22uF  [FP-CL21-IPC_C]
C23  10uF  [FP-CL21-IPC_A]
C24  0.1uF  [FP-CL21-IPC_A]
C25  10uF  [FP-CL21-IPC_A]
D12  25%  [LTST-C170KRKT_V]
D13  50%  [LTST-C170KRKT_V]
D14  75%  [LTST-C170KRKT_V]
D15  100%  [FP-LTST-C170GKT-MFG]
IC6  IP5306  [SOIC127P600X165-9N]
IC7  SY6280AAC  [SOT95P285X140-5N]
L2  1uH  [INDPM7366X300N]
R20  2Ω  [FP-CR0805-IPC_B]
R21  10k  [FP-MCR10-IPC_C]
R22  0.5Ω  [FP-MCR10-IPC_C]
R23  6.8k          Rset  [FP-MCR10-IPC_C]
SW2  430181038816  [WS-TASV_L4.5W4.5H3.8_430181038816]  (value not drawn)
TP7  TPAD6R  [TP06R]  (value not drawn)  (no BOM)

### Blocks framed on the sheet
Battery 2 Charging and Level Indication: C16-C22 D12-D15 IC6 L2 R20-R22 SW2 TP7
Overcurrent and Short Circuit Protection: C23-C25 IC7 R23

### Ports
BAT2 (out, see EduSAT-EPSv2[3C], BatteryConn&Protection[3B]), VIN (in, see EduSAT-EPSv2[2B], Charging&1AOut1[1A], Charging&1AOut3[1A], PowerInput&Switch[4C]), VOUT (out, see EduSAT-EPSv2[3B], Charging&1AOut1[2C], Charging&1AOut3[2C], PowerOutput&Switch[1A])

### Nets
GND: C16.2 C17.2 C18.2 C19.2 C20.2 C21.2 C22.2 C23.2 C24.2 C25.2 IC6.9(EP) IC7.2(GND) R23.2 SW2.B1
BAT2: C18.1 IC6.6(BAT) L2.2 R22.1 ; port BAT2
IC6KEY: IC6.5(KEY) R21.1
IC6LED1: D12.1(A) D13.2(K) IC6.2(LED1)
IC6LED2: D14.1(A) D15.1(C) IC6.3(LED2)
IC6LED3: D12.2(K) D13.1(A) D14.2(K) D15.2(A) IC6.4(LED3)
IC6SW: IC6.7(SW) L2.1
IC7ISET: IC7.3(ISET) R23.1
SY6280-2: C20.1 C21.1 C22.1 C23.1 IC6.8(VOUT) IC7.4(EN) IC7.5(IN) TP7.1(TP)
VIN: C17.1 IC6.1(VIN) R20.1 ; port VIN
VOUT: C24.1 C25.1 IC7.1(OUT) ; port VOUT
NetC16_1: C16.1 R20.2
NetC19_1: C19.1 R22.2
NetR21_2: R21.2 SW2.A1

Not connected (* = marked no-connect by the designer): SW2 A2* B2*

### Notes on the sheet
- Battery 2 Charging and Power Output Circuit
- Overcurrent threshold = 6800 / Rset
  6800 / 6.8k = 1A
  VOUT2 = 5V 1A
- EduSAT EPS v2
- Denis G. Wachira

### Library data of the parts
C16 C17 C23 C25 = CMP-13271-002975-1: as C6 on sheet Charging&1AOut1; Case Code (Imperial): 0805; Length: 2mm; Case/Package: 0805; Packaging: Tape and Reel; Width: 0.049inch; Tolerance: 10%; Mount: Surface Mount; Min Operating Temperature: -55°C; Thickness: 0.057inch; Height: 1.25mm; Dielectric: X5R; Package Quantity: 1; Depth: 1.25mm; Capacitance: 10uF; Voltage Rating: 25V; Case Code (Metric): 2012; Max Operating Temperature: 85°C; Radiation Hardening: No
C18-C22 = CMP-13271-003225-1: as C8 on sheet Charging&1AOut1
C24 = CMP-13271-002975-1: as C3 on sheet BatteryConn&Protection; Case Code (Imperial): 0805; Length: 2mm; Case/Package: 0805; Packaging: Tape and Reel; Width: 0.049inch; Tolerance: 10%; Mount: Surface Mount; Min Operating Temperature: -55°C; Thickness: 0.057inch; Height: 1.25mm; Dielectric: X7R; Package Quantity: 1; Depth: 1.25mm; Capacitance: 0.1uF; Voltage Rating: 50V; Case Code (Metric): 2012; Max Operating Temperature: 85°C; Radiation Hardening: No
D12 = CMP-2000-07593-1: as D8 on sheet Charging&1AOut1; Min Operating Temperature: -55degC; RoHSCompliant: True; Length: 3.2mm; Width: 1.25mm; Mount: SurfaceMount; Packaging: TapeandReel; Number of LEDs: 1; Radiation Hardening: No; Datasheet URL: http://optoelectronics.liteon.com/upload/download/DS-22-99-0150/LTST-C170KRKT.pdf; Datasheet Version: Rev. D, 11/2014; Case Code (Metric): 2012; Height: 1.1mm; Number of Pins: 2; Package Description: 2-Pin Surface Mount Device, Body 2 x 1.25 mm; Manufacturer URL: http://www.us.liteon.com/; Lead Free: LeadFree; Illumination Colour: Red; Colour: Red; Case Code (Imperial): 0805; Max Operating Temperature: 85degC; Power Dissipation: 75mW; Mounting Technology: SurfaceMount; Package Reference: C170KRKT; Package Quantity: 1; Depth: 1.6mm
D13 D14 = CMP-2000-07593-1: as D9 on sheet Charging&1AOut1; Min Operating Temperature: -55degC; RoHSCompliant: True; Length: 3.2mm; Width: 1.25mm; Mount: SurfaceMount; Packaging: TapeandReel; Number of LEDs: 1; Radiation Hardening: No; Datasheet URL: http://optoelectronics.liteon.com/upload/download/DS-22-99-0150/LTST-C170KRKT.pdf; Datasheet Version: Rev. D, 11/2014; Case Code (Metric): 2012; Height: 1.1mm; Number of Pins: 2; Package Description: 2-Pin Surface Mount Device, Body 2 x 1.25 mm; Manufacturer URL: http://www.us.liteon.com/; Lead Free: LeadFree; Illumination Colour: Red; Colour: Red; Case Code (Imperial): 0805; Max Operating Temperature: 85degC; Power Dissipation: 75mW; Mounting Technology: SurfaceMount; Package Reference: C170KRKT; Package Quantity: 1; Depth: 1.6mm
D15 = CMP-1674-00002-6: as D11 on sheet Charging&1AOut1; Min Operating Temperature: -55°C; Number of Pins: 2; Max Operating Temperature: 85°C; Color: Green; Radiation Hardening: No; Illumination Color: Green; Case Code (Metric): 2012; Lens Transparency: Clear; Case/Package: 0805; Width: 1.25mm; Case Code (Imperial): 0805; Package Quantity: 1; Height: 1.1mm; Depth: 1.25mm; Length: 2mm; Power Rating: 100mW; Lead Free: Lead Free; Number of LEDs: 1; Packaging: Tape and Reel; Mount: Surface Mount; Voltage: 5V
IC6 = IP5306: as IC4 on sheet Charging&1AOut1; Datasheet Link: https://datasheetspdf.com/pdf-file/1139129/Injoinic/IP5306/1; Height: 1.65mm; Manufacturer_Part_Number: IP5306
IC7 = SY6280AAC: as IC5 on sheet Charging&1AOut1; Datasheet Link: https://datasheet.lcsc.com/szlcsc/Silergy-Corp-SY6280AAC_C55136.pdf; Height: 1.4mm; Manufacturer_Part_Number: SY6280AAC
L2 = MCS0630-2R2MN2: as L1 on sheet Charging&1AOut1; Height: 3mm; Manufacturer_Part_Number: MCS0630-1R0MN2
R20 = CMP-07231-004400-1: as R16 on sheet Charging&1AOut1; Packaging: Tape and Reel; Thickness: 508um; Case Code (Metric): 2012; Military Standard: Not; Height: 0.5mm; Depth: 1.25mm; Weight: 0.000194oz; Length: 2mm; Resistance: 2Ω; Min Operating Temperature: -55°C; Radiation Hardening: No; Case/Package: 0805; Tolerance: 1%; Mount: Surface Mount; Width: 1.25mm; Max Operating Temperature: 155°C; Contact Plating: Tin; Temperature Coefficient: 250ppm/°C; Case Code (Imperial): 0805; Composition: Thick Film; Termination: SMD/SMT
R21 = CMP-08839-012433-1: as R17 on sheet Charging&1AOut1; Resistor Type: Thick Film; Contact Plating: Tin; Length: 2mm; Tolerance: 1%; Temperature Coefficient: 100ppm/°C; Max Operating Temperature: 155°C; Min Operating Temperature: -55°C; Height: 550um; Voltage Rating (DC): 150V; Mount: Surface Mount; Case/Package: 0805; Lead Free: Lead Free; Width: 1.25mm; Radiation Hardening: No; Working Voltage: 150V; Number of Terminations: 2
R22 = CMP-08839-012433-1: as R18 on sheet Charging&1AOut1; Resistor Type: Thick Film; Contact Plating: Tin; Length: 2mm; Tolerance: 1%; Temperature Coefficient: 100ppm/°C; Max Operating Temperature: 155°C; Min Operating Temperature: -55°C; Height: 550um; Voltage Rating (DC): 150V; Mount: Surface Mount; Case/Package: 0805; Lead Free: Lead Free; Width: 1.25mm; Radiation Hardening: No; Working Voltage: 150V; Number of Terminations: 2
R23 = CMP-08839-012433-1: as R19 on sheet Charging&1AOut1; Resistor Type: Thick Film; Contact Plating: Tin; Length: 2mm; Tolerance: 1%; Temperature Coefficient: 100ppm/°C; Max Operating Temperature: 155°C; Min Operating Temperature: -55°C; Height: 550um; Voltage Rating (DC): 150V; Mount: Surface Mount; Case/Package: 0805; Lead Free: Lead Free; Width: 1.25mm; Radiation Hardening: No; Working Voltage: 150V; Number of Terminations: 2
SW2 = CMP-1454-00001-2: as SW1 on sheet Charging&1AOut1; Current Rating: 50mA; RoHS: Compliant; Termination: SMD/SMT; Packaging: Tape and Reel; Height: 3.8mm; Mount: Surface Mount; Max Operating Temperature: 85°C; Voltage Rating: 12V; Contact Plating: Silver; Min Operating Temperature: -40°C
TP7 = CMP-00028-00002-2: 0.6mm round; Pins: 1

## Sheet Charging&1AOut3.SchDoc
size A; DocumentNumber: 6; SheetNumber: 6; SheetTotal: 7
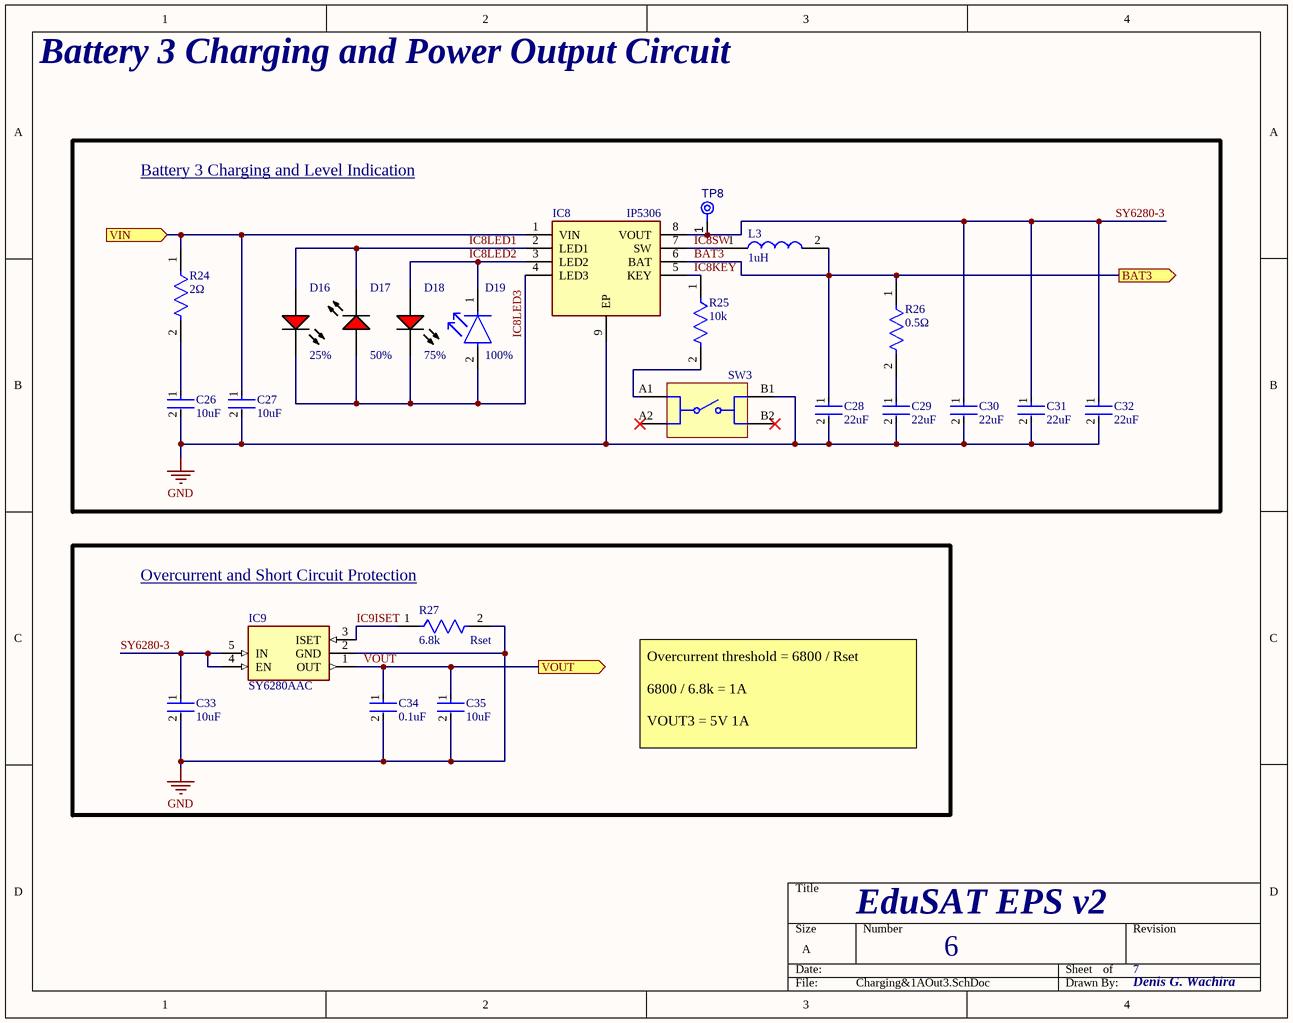
[diagram p5: Charging&1AOut3.SchDoc]

### Parts
C26  10uF  [FP-CL21-IPC_A]
C27  10uF  [FP-CL21-IPC_A]
C28  22uF  [FP-CL21-IPC_C]
C29  22uF  [FP-CL21-IPC_C]
C30  22uF  [FP-CL21-IPC_C]
C31  22uF  [FP-CL21-IPC_C]
C32  22uF  [FP-CL21-IPC_C]
C33  10uF  [FP-CL21-IPC_A]
C34  0.1uF  [FP-CL21-IPC_A]
C35  10uF  [FP-CL21-IPC_A]
D16  25%  [LTST-C170KRKT_V]
D17  50%  [LTST-C170KRKT_V]
D18  75%  [LTST-C170KRKT_V]
D19  100%  [FP-LTST-C170GKT-MFG]
IC8  IP5306  [SOIC127P600X165-9N]
IC9  SY6280AAC  [SOT95P285X140-5N]
L3  1uH  [INDPM7366X300N]
R24  2Ω  [FP-CR0805-IPC_B]
R25  10k  [FP-MCR10-IPC_C]
R26  0.5Ω  [FP-MCR10-IPC_C]
R27  6.8k          Rset  [FP-MCR10-IPC_C]
SW3  430181038816  [WS-TASV_L4.5W4.5H3.8_430181038816]  (value not drawn)
TP8  TPAD6R  [TP06R]  (value not drawn)  (no BOM)

### Blocks framed on the sheet
Battery 3 Charging and Level Indication: C26-C32 D16-D19 IC8 L3 R24-R26 SW3 TP8
Overcurrent and Short Circuit Protection: C33-C35 IC9 R27

### Ports
BAT3 (out, see EduSAT-EPSv2[3C], BatteryConn&Protection[3C]), VIN (in, see EduSAT-EPSv2[2C], Charging&1AOut1[1A], Charging&1AOut2[1A], PowerInput&Switch[4C]), VOUT (out, see EduSAT-EPSv2[3C], Charging&1AOut1[2C], Charging&1AOut2[2C], PowerOutput&Switch[1A])

### Nets
GND: C26.2 C27.2 C28.2 C29.2 C30.2 C31.2 C32.2 C33.2 C34.2 C35.2 IC8.9(EP) IC9.2(GND) R27.2 SW3.B1
BAT3: C28.1 IC8.6(BAT) L3.2 R26.1 ; port BAT3
IC8KEY: IC8.5(KEY) R25.1
IC8LED1: D16.1(A) D17.2(K) IC8.2(LED1)
IC8LED2: D18.1(A) D19.1(C) IC8.3(LED2)
IC8LED3: D16.2(K) D17.1(A) D18.2(K) D19.2(A) IC8.4(LED3)
IC8SW: IC8.7(SW) L3.1
IC9ISET: IC9.3(ISET) R27.1
SY6280-3: C30.1 C31.1 C32.1 C33.1 IC8.8(VOUT) IC9.4(EN) IC9.5(IN) TP8.1(TP)
VIN: C27.1 IC8.1(VIN) R24.1 ; port VIN
VOUT: C34.1 C35.1 IC9.1(OUT) ; port VOUT
NetC26_1: C26.1 R24.2
NetC29_1: C29.1 R26.2
NetR25_2: R25.2 SW3.A1

Not connected (* = marked no-connect by the designer): SW3 A2* B2*

### Notes on the sheet
- Battery 3 Charging and Power Output Circuit
- Overcurrent threshold = 6800 / Rset
  6800 / 6.8k = 1A
  VOUT3 = 5V 1A
- EduSAT EPS v2
- Denis G. Wachira

### Library data of the parts
C26 C27 C33 C35 = CMP-13271-002975-1: as C6 on sheet Charging&1AOut1; Case Code (Imperial): 0805; Length: 2mm; Case/Package: 0805; Packaging: Tape and Reel; Width: 0.049inch; Tolerance: 10%; Mount: Surface Mount; Min Operating Temperature: -55°C; Thickness: 0.057inch; Height: 1.25mm; Dielectric: X5R; Package Quantity: 1; Depth: 1.25mm; Capacitance: 10uF; Voltage Rating: 25V; Case Code (Metric): 2012; Max Operating Temperature: 85°C; Radiation Hardening: No
C28-C32 = CMP-13271-003225-1: as C8 on sheet Charging&1AOut1
C34 = CMP-13271-002975-1: as C3 on sheet BatteryConn&Protection; Case Code (Imperial): 0805; Length: 2mm; Case/Package: 0805; Packaging: Tape and Reel; Width: 0.049inch; Tolerance: 10%; Mount: Surface Mount; Min Operating Temperature: -55°C; Thickness: 0.057inch; Height: 1.25mm; Dielectric: X7R; Package Quantity: 1; Depth: 1.25mm; Capacitance: 0.1uF; Voltage Rating: 50V; Case Code (Metric): 2012; Max Operating Temperature: 85°C; Radiation Hardening: No
D16 = CMP-2000-07593-1: as D8 on sheet Charging&1AOut1; Min Operating Temperature: -55degC; RoHSCompliant: True; Length: 3.2mm; Width: 1.25mm; Mount: SurfaceMount; Packaging: TapeandReel; Number of LEDs: 1; Radiation Hardening: No; Datasheet URL: http://optoelectronics.liteon.com/upload/download/DS-22-99-0150/LTST-C170KRKT.pdf; Datasheet Version: Rev. D, 11/2014; Case Code (Metric): 2012; Height: 1.1mm; Number of Pins: 2; Package Description: 2-Pin Surface Mount Device, Body 2 x 1.25 mm; Manufacturer URL: http://www.us.liteon.com/; Lead Free: LeadFree; Illumination Colour: Red; Colour: Red; Case Code (Imperial): 0805; Max Operating Temperature: 85degC; Power Dissipation: 75mW; Mounting Technology: SurfaceMount; Package Reference: C170KRKT; Package Quantity: 1; Depth: 1.6mm
D17 D18 = CMP-2000-07593-1: as D9 on sheet Charging&1AOut1; Min Operating Temperature: -55degC; RoHSCompliant: True; Length: 3.2mm; Width: 1.25mm; Mount: SurfaceMount; Packaging: TapeandReel; Number of LEDs: 1; Radiation Hardening: No; Datasheet URL: http://optoelectronics.liteon.com/upload/download/DS-22-99-0150/LTST-C170KRKT.pdf; Datasheet Version: Rev. D, 11/2014; Case Code (Metric): 2012; Height: 1.1mm; Number of Pins: 2; Package Description: 2-Pin Surface Mount Device, Body 2 x 1.25 mm; Manufacturer URL: http://www.us.liteon.com/; Lead Free: LeadFree; Illumination Colour: Red; Colour: Red; Case Code (Imperial): 0805; Max Operating Temperature: 85degC; Power Dissipation: 75mW; Mounting Technology: SurfaceMount; Package Reference: C170KRKT; Package Quantity: 1; Depth: 1.6mm
D19 = CMP-1674-00002-6: as D11 on sheet Charging&1AOut1; Min Operating Temperature: -55°C; Number of Pins: 2; Max Operating Temperature: 85°C; Color: Green; Radiation Hardening: No; Illumination Color: Green; Case Code (Metric): 2012; Lens Transparency: Clear; Case/Package: 0805; Width: 1.25mm; Case Code (Imperial): 0805; Package Quantity: 1; Height: 1.1mm; Depth: 1.25mm; Length: 2mm; Power Rating: 100mW; Lead Free: Lead Free; Number of LEDs: 1; Packaging: Tape and Reel; Mount: Surface Mount; Voltage: 5V
IC8 = IP5306: as IC4 on sheet Charging&1AOut1; Datasheet Link: https://datasheetspdf.com/pdf-file/1139129/Injoinic/IP5306/1; Height: 1.65mm; Manufacturer_Part_Number: IP5306
IC9 = SY6280AAC: as IC5 on sheet Charging&1AOut1; Datasheet Link: https://datasheet.lcsc.com/szlcsc/Silergy-Corp-SY6280AAC_C55136.pdf; Height: 1.4mm; Manufacturer_Part_Number: SY6280AAC
L3 = MCS0630-2R2MN2: as L1 on sheet Charging&1AOut1; Height: 3mm; Manufacturer_Part_Number: MCS0630-1R0MN2
R24 = CMP-07231-004400-1: as R16 on sheet Charging&1AOut1; Packaging: Tape and Reel; Thickness: 508um; Case Code (Metric): 2012; Military Standard: Not; Height: 0.5mm; Depth: 1.25mm; Weight: 0.000194oz; Length: 2mm; Resistance: 2Ω; Min Operating Temperature: -55°C; Radiation Hardening: No; Case/Package: 0805; Tolerance: 1%; Mount: Surface Mount; Width: 1.25mm; Max Operating Temperature: 155°C; Contact Plating: Tin; Temperature Coefficient: 250ppm/°C; Case Code (Imperial): 0805; Composition: Thick Film; Termination: SMD/SMT
R25 = CMP-08839-012433-1: as R17 on sheet Charging&1AOut1; Resistor Type: Thick Film; Contact Plating: Tin; Length: 2mm; Tolerance: 1%; Temperature Coefficient: 100ppm/°C; Max Operating Temperature: 155°C; Min Operating Temperature: -55°C; Height: 550um; Voltage Rating (DC): 150V; Mount: Surface Mount; Case/Package: 0805; Lead Free: Lead Free; Width: 1.25mm; Radiation Hardening: No; Working Voltage: 150V; Number of Terminations: 2
R26 = CMP-08839-012433-1: as R18 on sheet Charging&1AOut1; Resistor Type: Thick Film; Contact Plating: Tin; Length: 2mm; Tolerance: 1%; Temperature Coefficient: 100ppm/°C; Max Operating Temperature: 155°C; Min Operating Temperature: -55°C; Height: 550um; Voltage Rating (DC): 150V; Mount: Surface Mount; Case/Package: 0805; Lead Free: Lead Free; Width: 1.25mm; Radiation Hardening: No; Working Voltage: 150V; Number of Terminations: 2
R27 = CMP-08839-012433-1: as R19 on sheet Charging&1AOut1; Resistor Type: Thick Film; Contact Plating: Tin; Length: 2mm; Tolerance: 1%; Temperature Coefficient: 100ppm/°C; Max Operating Temperature: 155°C; Min Operating Temperature: -55°C; Height: 550um; Voltage Rating (DC): 150V; Mount: Surface Mount; Case/Package: 0805; Lead Free: Lead Free; Width: 1.25mm; Radiation Hardening: No; Working Voltage: 150V; Number of Terminations: 2
SW3 = CMP-1454-00001-2: as SW1 on sheet Charging&1AOut1; Current Rating: 50mA; RoHS: Compliant; Termination: SMD/SMT; Packaging: Tape and Reel; Height: 3.8mm; Mount: Surface Mount; Max Operating Temperature: 85°C; Voltage Rating: 12V; Contact Plating: Silver; Min Operating Temperature: -40°C
TP8 = CMP-00028-00002-2: 0.6mm round; Pins: 1

## Sheet PowerOutput&Switch.SchDoc
size A; DocumentNumber: 7; SheetNumber: 7; SheetTotal: 7
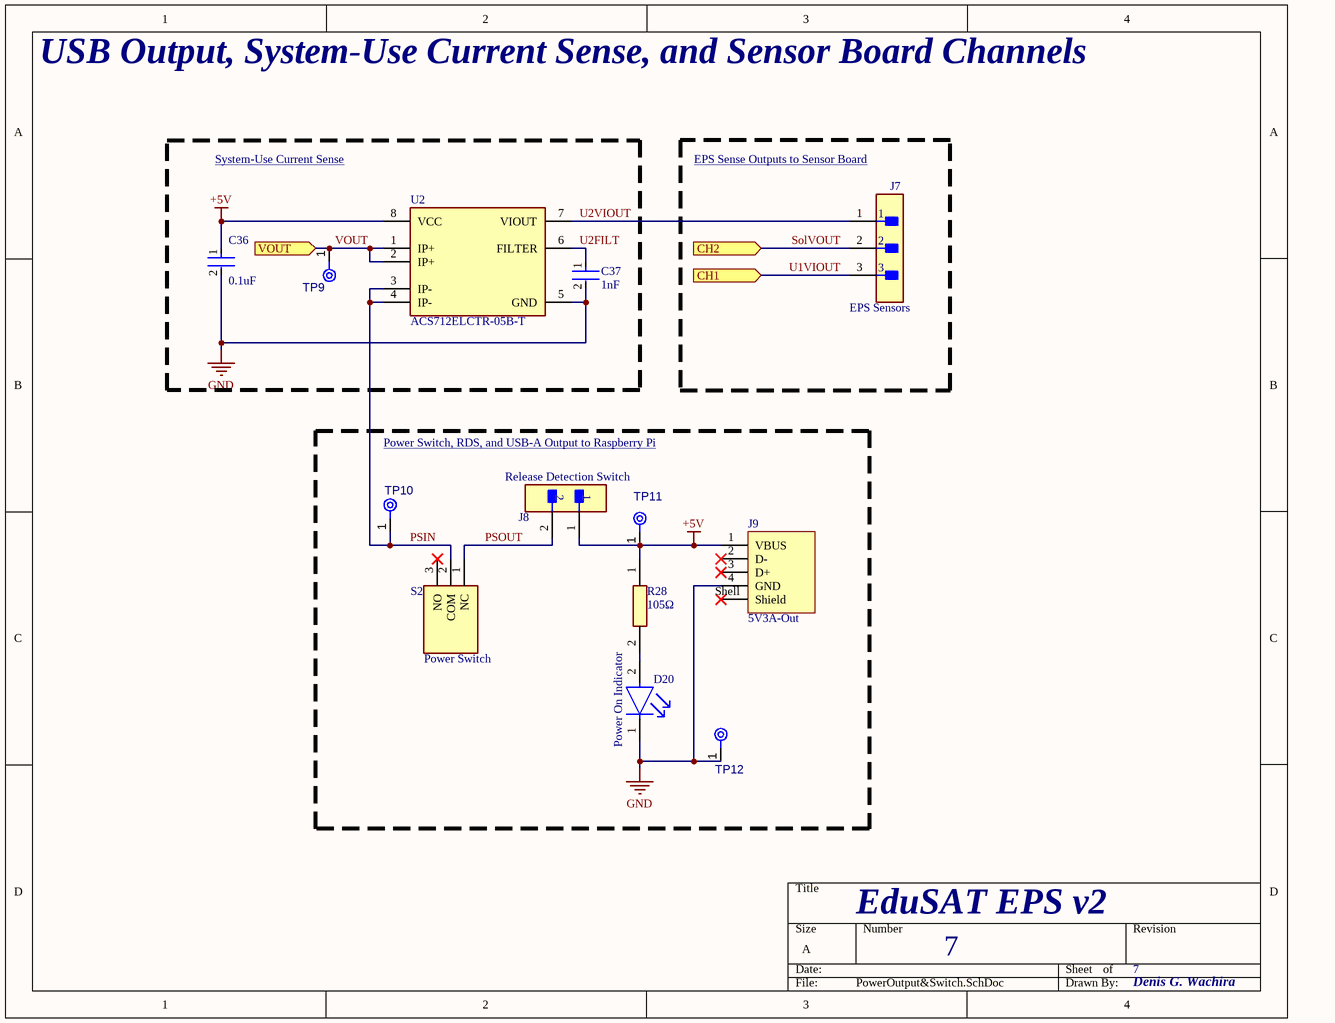
[diagram p6: PowerOutput&Switch.SchDoc]

### Parts
C36  0.1uF  [FP-CL21-IPC_A]
C37  1nF  [FP-CL21-IPC_B]
D20  Power On Indicator  [FP-LTST-C170GKT-MFG]
J7  EPS Sensors  [FP-S3B-XH-A-1_LF_SN-MFG]
J8  Release Detection Switch  [FP-S2B-XH-A-1_LF_SN-MFG]
J9  5V3A-Out  [614004135023]
R28  105Ω  [RESC2012X65N]
S2  Power Switch  [SS12D10L3]
TP9  TPAD6R  [TP06R]  (value not drawn)  (no BOM)
TP10  TPAD6R  [TP06R]  (value not drawn)  (no BOM)
TP11  TPAD6R  [TP06R]  (value not drawn)  (no BOM)
TP12  TPAD6R  [TP06R]  (value not drawn)  (no BOM)
U2  ACS712ELCTR-05B-T  [FP-LC-8-IPC_A]

### Blocks framed on the sheet
System-Use Current Sense: C36 C37 TP9 U2
EPS Sense Outputs to Sensor Board: J7
Power Switch, RDS, and USB-A Output to Raspberry Pi: D20 J8 J9 R28 S2 TP10-TP12

### Ports
CH1 (in, see EduSAT-EPSv2[3B], PowerInput&Switch[4A]), CH2 (in, see EduSAT-EPSv2[3B], PowerInput&Switch[2B]), VOUT (in, see EduSAT-EPSv2[3B], Charging&1AOut1[2C], Charging&1AOut2[2C], Charging&1AOut3[2C])

### Nets
+5V: C36.1 J8.1 J9.1(VBUS) R28.1 TP11.1(TP) U2.8(VCC)
GND: C36.2 C37.2 D20.1(C) J9.4(GND) TP12.1(TP) U2.5(GND)
PSIN: S2.2(COM) TP10.1(TP) U2.3(IP-) U2.4(IP-)
PSOUT: J8.2 S2.1(NC)
SolVOUT: J7.2 ; port CH2
U1VIOUT: J7.3 ; port CH1
U2FILT: C37.1 U2.6(FILTER)
U2VIOUT: J7.1 U2.7(VIOUT)
VOUT: TP9.1(TP) U2.1(IP+) U2.2(IP+) ; port VOUT
NetD20_2: D20.2(A) R28.2

Not connected (* = marked no-connect by the designer): J9 2(D-)* 3(D+)* Shell(Shield)*; S2 3(NO)*

### Notes on the sheet
- USB Output, System-Use Current Sense, and Sensor Board Channels
- EduSAT EPS v2
- Denis G. Wachira

### Library data of the parts
C36 = CMP-13271-002975-1: as C3 on sheet BatteryConn&Protection; Case Code (Imperial): 0805; Length: 2mm; Case/Package: 0805; Packaging: Tape and Reel; Width: 0.049inch; Tolerance: 10%; Mount: Surface Mount; Min Operating Temperature: -55°C; Thickness: 0.057inch; Height: 1.25mm; Dielectric: X7R; Package Quantity: 1; Depth: 1.25mm; Capacitance: 0.1uF; Voltage Rating: 50V; Case Code (Metric): 2012; Max Operating Temperature: 85°C; Radiation Hardening: No
C37 = CMP-13271-001800-1: as C1 on sheet PowerInput&Switch; Contact Plating: Tin; Tolerance: 10%; Package Quantity: 4000; Voltage: 50V; Mount: Surface Mount; Material: Ceramic; Width: 0.049inch; Capacitance: 1nF; Case Code (Metric): 2012; Case Code (Imperial): 0805; Height: 0.65mm; Max Operating Temperature: 125°C; Thickness: 0.03inch; Length: 2mm; Radiation Hardening: No; Depth: 1.25mm; Packaging: Tape and Reel; Voltage Rating: 50V; Dielectric: X7R; Min Operating Temperature: -55°C; Case/Package: 0805
D20 = CMP-1674-00002-6: as D11 on sheet Charging&1AOut1; Min Operating Temperature: -55°C; Number of Pins: 2; Max Operating Temperature: 85°C; Color: Green; Radiation Hardening: No; Illumination Color: Green; Case Code (Metric): 2012; Lens Transparency: Clear; Case/Package: 0805; Width: 1.25mm; Case Code (Imperial): 0805; Package Quantity: 1; Height: 1.1mm; Depth: 1.25mm; Length: 2mm; Power Rating: 100mW; Lead Free: Lead Free; Number of LEDs: 1; Packaging: Tape and Reel; Mount: Surface Mount; Voltage: 5V
J7 = CMP-17439-000427-1: CONN HEADER R/A 3POS 2.5MM / HCZZ0139-3; Voltage Rating: 250V; Pitch: 0.098inch; Number of Positions: 3; Contact Finish - Mating: TIN; Mount: Through Hole; Lead Free: Lead Free; Termination: Press-Fit; Fastening Type: Detent; Insulation Material: Nylon; Min Operating Temperature: -25°C; Flammability Rating: UL94 V-0; Number of Rows: 1; Contact Plating: Tin; Max Operating Temperature: 85°C; Color: Natural; Package Quantity: 1000; Insulation Color: Natural; Contact Material: Brass; Series: XH; Connector Type: Header; Contact Shape: Square; Packaging: Bulk; Contact Type: Male Pin
J8 = CMP-17439-000260-1: as J4 on sheet BatteryConn&Protection; Contact Material: Brass; Series: XH; Contact Finish - Mating: TIN; Max Operating Temperature: 85°C; Number of Rows: 1; Packaging: Bulk; Insulation Color: Natural; Lead Free: Lead Free; Fastening Type: Detent; Termination: Press-Fit; Connector Type: Header; Insulation Material: Nylon; Contact Shape: Square; Contact Type: Male Pin; Mount: Through Hole; Min Operating Temperature: -25°C; Flammability Rating: UL94 V-0
J9 = CMP-1502-03236-2: USB 2.0 3A 1 Straight 4P Female -55℃~+85℃ Type-A Plugin USB Connectors ROHS / 916-252A1113Y10210; NexarPartId: 18818178; Number of Positions: 4; Insulation Resistance: 1GΩ; Gender: Receptacle; Number of Ports: 1; Contact Resistance: 20mΩ; Operating Supply Voltage: 30V; Current Rating: 1.5A; USB Standard: USB 2.0; Number of Pins: 4; Orientation: Vertical; Features: Shielded; Min Operating Temperature: -40°C; Number of Contacts: 4; REACH SVHC: Unknown; Contact Plating: Gold; Color: White; Termination: Solder; Connector Type: USB; Contact Material: Gold; Height: 15.2mm; Insulation Material: PBT; Mount: Through Hole, Vertical; Max Operating Temperature: 105°C; Length: 15.7mm; Voltage Rating: 30V; RoHS: Compliant; Width: 18.8mm; Lead Free: Lead Free
R28 = AECR0805F27R0K9: as R4 on sheet PowerInput&Switch; Datasheet Link: https://datasheet.lcsc.com/lcsc/2304140030_RESI-AECR0805F27R0K9_C352233.pdf; Height: 0.65mm; Manufacturer_Part_Number: AECR0805F27R0K9
S2 = SS-12D10L3: as S1 on sheet PowerInput&Switch; Datasheet Link: http://www.helloxkb.com/public/images/pdf/SS-12D10XXX.pdf; Height: 9.6mm; Manufacturer_Part_Number: SS-12D10L3
TP9-TP12 = CMP-00028-00002-2: 0.6mm round; Pins: 1
U2 = CMP-2000-04989-2: as U1 on sheet PowerInput&Switch; Mount: Surface Mount; Max Operating Temperature: 85°C; Min Operating Temperature: -40°C; Termination: SMD/SMT; Number of Pins: 8; Accuracy: 1.5%; Current Sensing: 5A; Length: 4.9mm; Package Quantity: 1; REACH SVHC: No SVHC; Packaging: Cut Tape; Series: -; Height: 1.5mm; Width: 3.9mm; Operating Supply Voltage: 5V; Bandwidth: 80kHz; Case/Package: SOIC; Lead Free: Lead Free; Quiescent Current: 10mA; RoHS Compliant: Yes